# EasyEDA Pro project BrushlessPowerSupply.eprj

# Schematic Schematic1
Board Name: Board1; Create Date: 2025-03-20; Page Name: P1; Project Name: BrushlessPowerSupply; Schematic Name: Schematic1; Update Date: 2025-03-26; Company: 嘉立创EDA; Drawed: 王大智; Page Size: A4; Version: V1.0
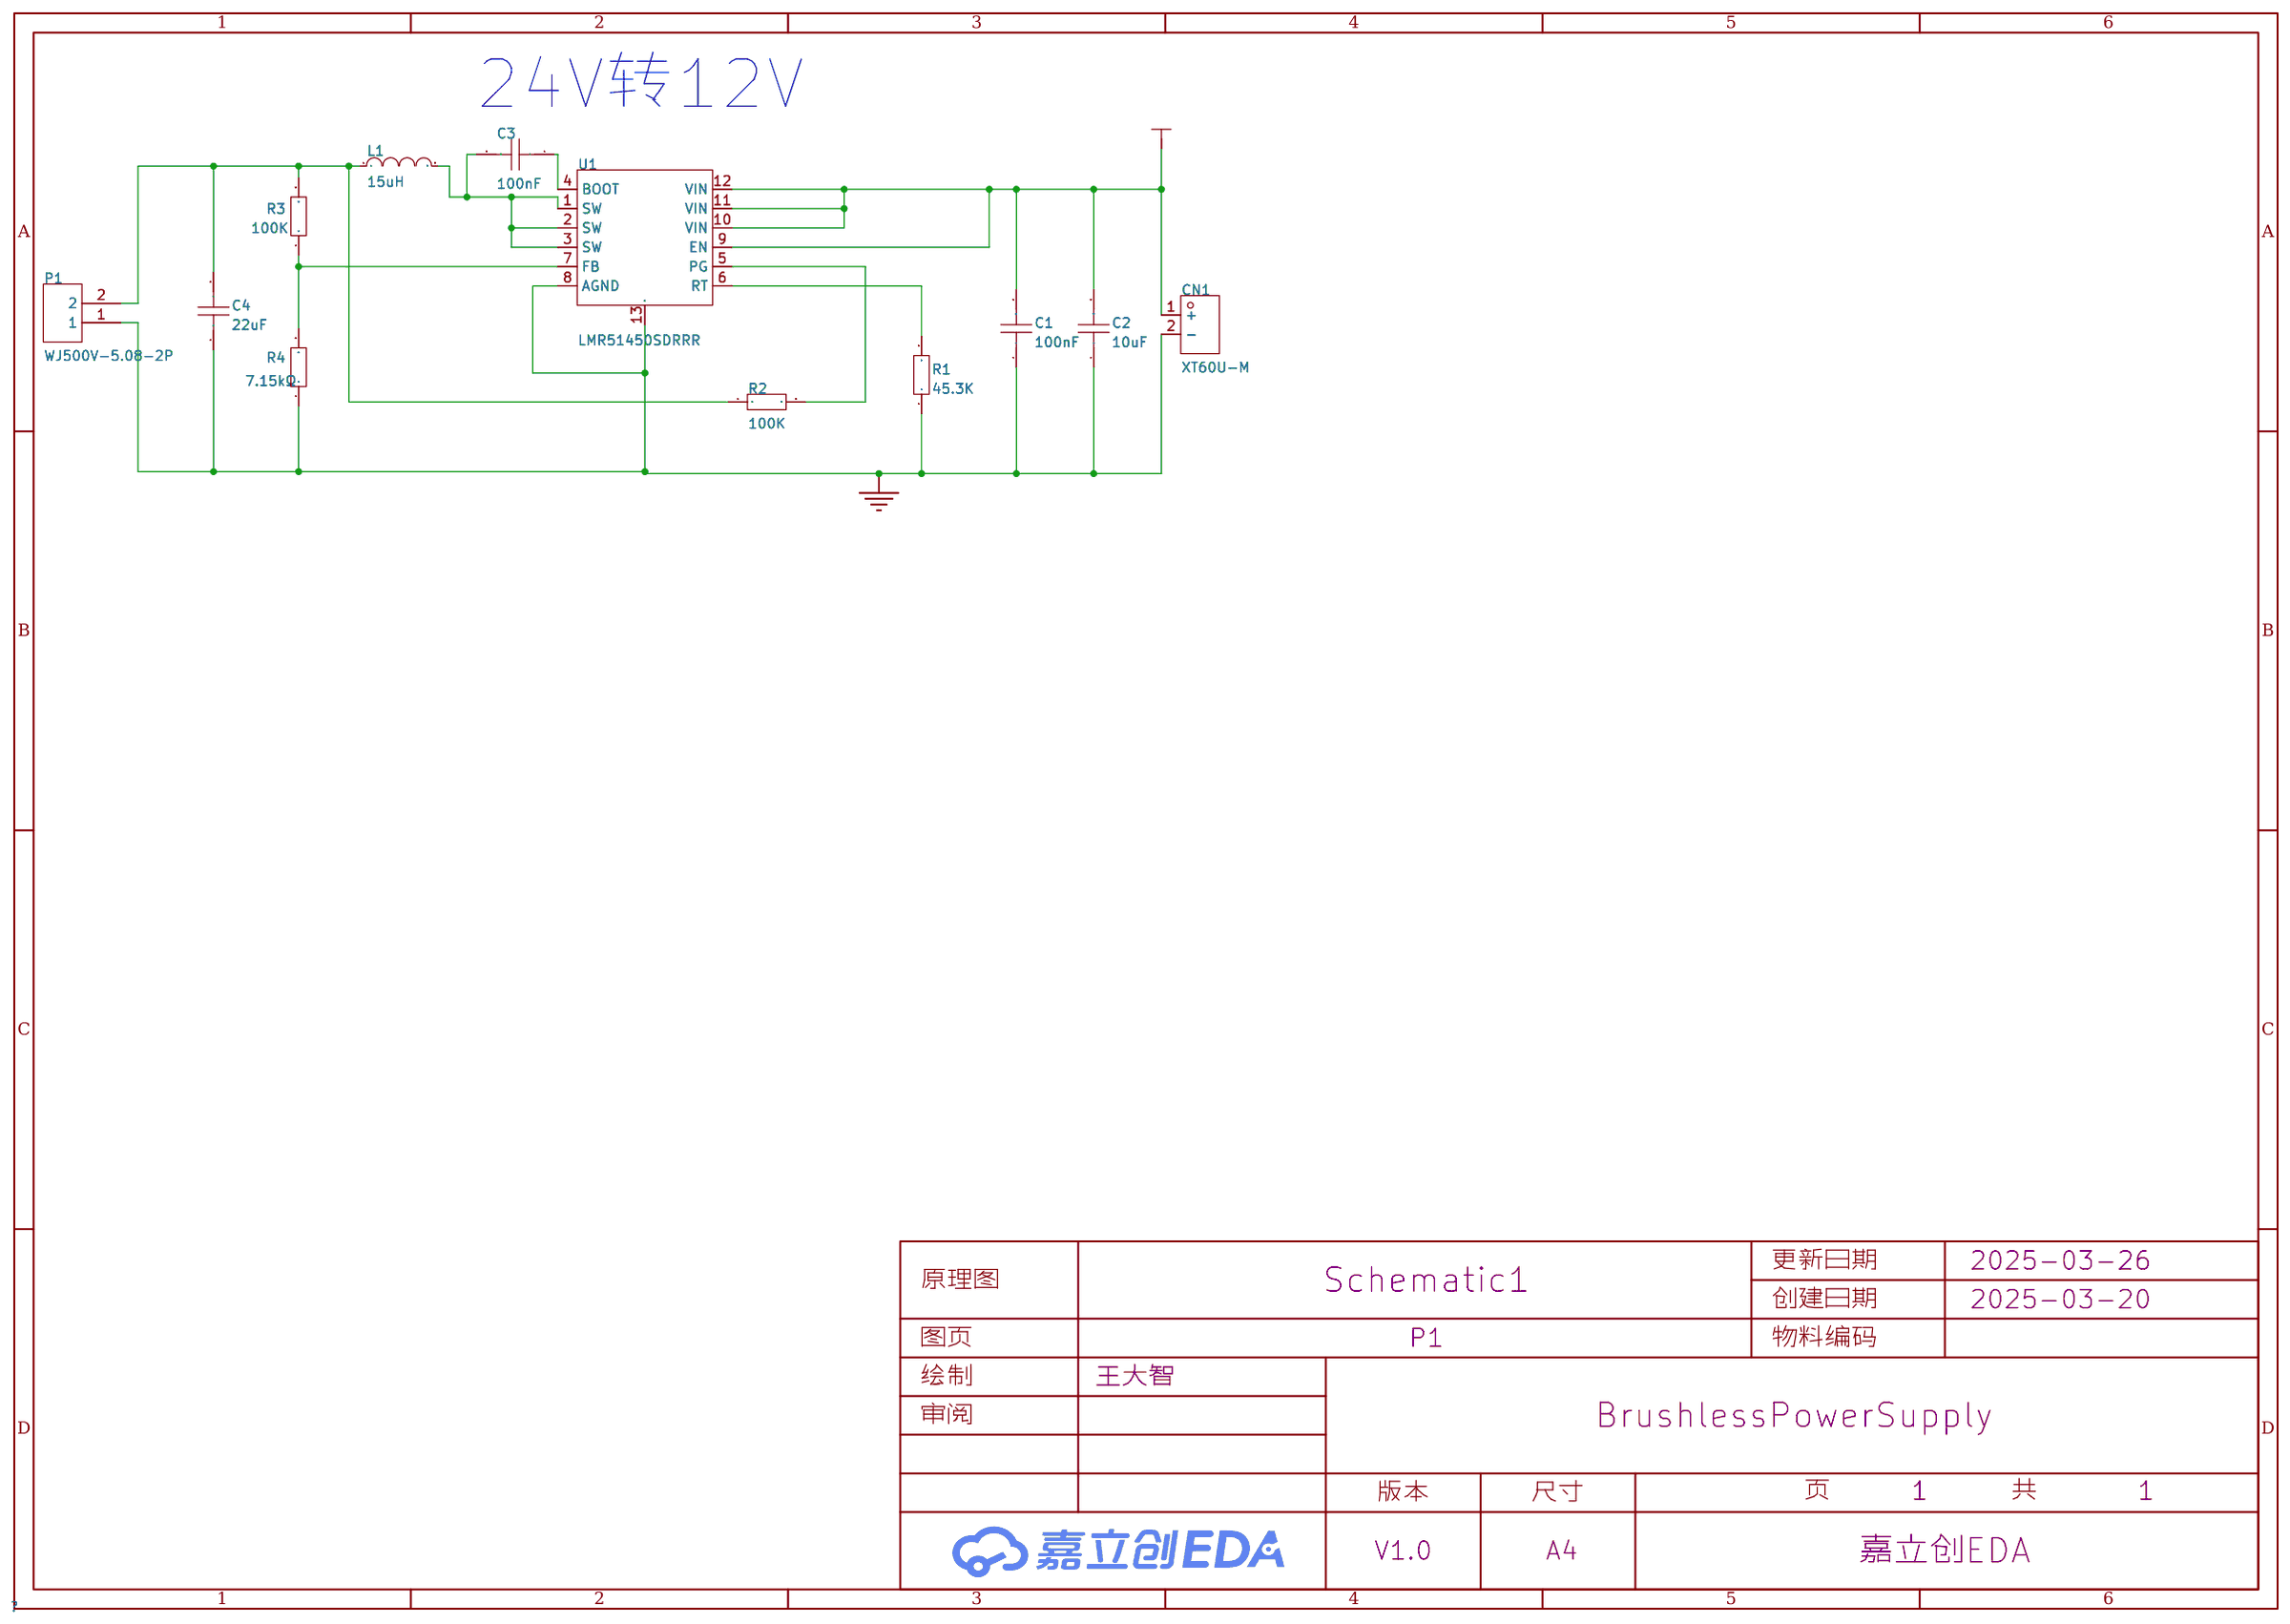
[diagram p0: schematic sheet]

## Parts
C1  100nF  [C0603]
C2  10uF  [C0603]
C3  100nF  [C0603]
C4  22uF  [C0603]
CN1  XT60U-M  [CONN-TH_XT60U-M]
L1  15uH  [L0603]
P1  WJ500V-5.08-2P  [CONN-TH_2P-P5.00_WJ500V-5.08-2P]
R1  45.3K  [R0603]
R2  100K  [R0603]
R3  100K  [R0603]
R4  7.15kΩ  [R0603]
U1  LMR51450SDRRR  [WSON-12_L3.0-W3.0-P0.50-TL-EP-2]

## Library data of the parts
C1-C4 = CAP_0603: Supplier Footprint: 0603
CN1 = XT60U-M: LCSC Part Name: AMASS(艾迈斯)连接器 大电流动力航空插头黄 公头 XT60U-M; Supplier Part: C129184; Manufacturer: AMASS(艾迈斯); JLCPCB Part Class: 扩展库; Datasheet: https://atta.szlcsc.com/upload/public/pdf/source/20180326/C129184_8CCD3C0E138803E0EF0E0B88AC9ACA57.pdf; Supplier: LCSC; Type: 插头; Colour: 黄色; InterfaceType: 公头
L1 = L_0603
P1 = WJ500V-5.08-2P: LCSC Part Name: 1x2P 5.08mm 直插 排数:1 每排P数:2; Supplier Part: C8465; Manufacturer: KANGNEX(康奈克斯电气); Supplier Footprint: 插件,P=5.08mm; JLCPCB Part Class: 扩展库; Datasheet: https://atta.szlcsc.com/upload/public/pdf/source/20191225/C8465_02D34CE5B5B4A53DF5891601D97FA9F4.pdf; Supplier: LCSC; Structure: 1x2P; Pitch: 5.08mm; Color: 绿色; Mounting Style: 直插; Current Rating (Max): 18A; Voltage Rating (Max): 250V; Number of Pins: 2P; Number of Rows: 1; Wire Gauge - AWG: 14~30; Wire Gauge - mm2: 2.5; Number of PINs Per Row: 2; Operating Temperature Range: -40℃~+105℃; Screw Specification: M2.5
R1-R3 = Res_0603: Supplier Footprint: 0603
R4 = 0603WAF7151T5E: LCSC Part Name: 7.15kΩ ±1% 100mW 厚膜电阻; Supplier Part: C25980; Manufacturer: UNI-ROYAL(厚声); Supplier Footprint: 0603; JLCPCB Part Class: Extended Part; Datasheet: https://atta.szlcsc.com/upload/public/pdf/source/20200306/C422600_1E6D84923E4A46A82E41ADD87F860B5C.pdf; Supplier: LCSC; Type: 厚膜电阻; Tolerance: ±1%; Power(Watts): 100mW; Overload Voltage (Max): 75V; Temperature Coefficient: ±100ppm/℃; Operating Temperature Range: -55℃~+155℃
U1 = LMR51450SDRRR: Supplier Part: C6890985; Manufacturer: TI(德州仪器); Supplier Footprint: WSON-12(3x3); JLCPCB Part Class: 扩展库; Datasheet: https://atta.szlcsc.com/upload/public/pdf/source/20230922/F8E6854F02BDF773C7F7ABAF4BB343E7.pdf; Supplier: LCSC; Function: 降压型; Output Type: 可调; Input Voltage: 4V~36V; Output Voltage: 800mV~28V; Output Current (Max): 5A; Switching Frequency: 1.1MHz; Operating Temperature: -40℃~+150℃@(TJ); Synchronous Rectification: 是; Number of Outputs: 1; Topology: 降压式; Switch tube (built-in/external): 内置

## Nets
+24V: C1.2 C2.2 CN1.1(+) U1.9(EN) U1.10(VIN) U1.11(VIN) U1.12(VIN)
GND: C1.1 C2.1 C4.1 CN1.2(-) P1.1 R1.1 R4.1 U1.8(AGND) U1.13(EP)
$1N598: R1.2 U1.6(RT)
$1N771: C3.1 U1.4(BOOT)
$1N912: R2.2 U1.5(PG)
$1N918: C4.2 L1.1 P1.2 R2.1 R3.2
$1N995: R3.1 R4.2 U1.7(FB)
$1N2165: C3.2 L1.2 U1.1(SW) U1.2(SW) U1.3(SW)

## Notes on the sheet
- 24V转12V

# Board PCB1
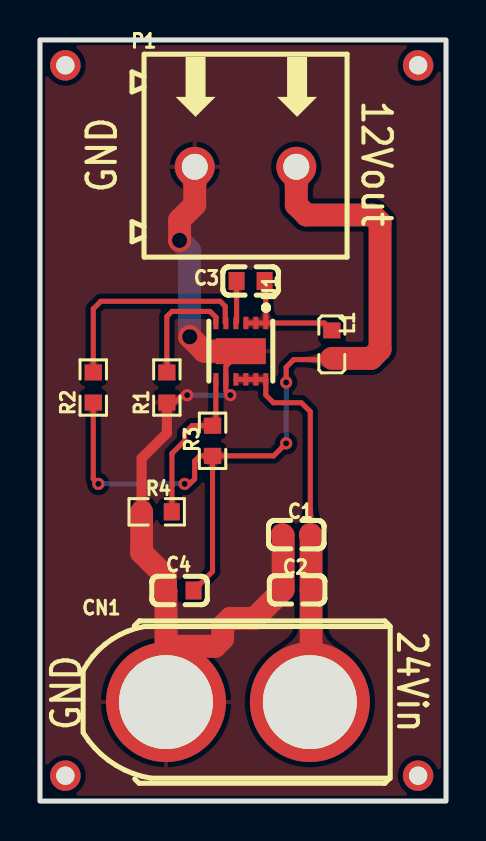
[diagram p1: board, top side]
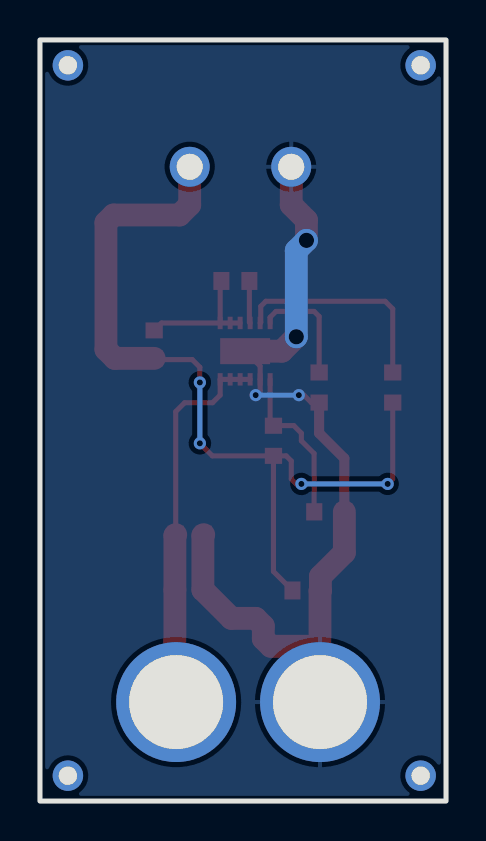
[diagram p2: board, bottom side, seen from below]

Outline 20.32 x 38.1 mm; copper layers: Top Layer, Bottom Layer. Coordinates in mm from the lower left corner of the outline.
Outline path: rectangle 0,38.1 20.32,0
Stack: Top Layer 0.035mm / Dielectric1 1.51mm FR4 er 4.5 / Bottom Layer 0.035mm

## Design rules (mm)
template: JLCPCB Capability(Two Layers Board)
spacing copperThickness1oz (default): track to track 0.102, other pairs 0.152 to 0.3
spacing copperThickness2oz: track to track 0.203, other pairs 0.152 to 0.3
track width copperThickness1oz (default): min 0.127, default 0.254, max 2.54
track width copperThickness2oz: min 0.203, default 0.254, max 2.54
differential pair differentialPair (default): width min 0.127, default 0.254, max 2.54; gap min 0.152, default 0.152
via viaSize (default): diameter min 0.5, default 0.61, max 10; hole min 0.3, default 0.305, max 6.3

## Placement (name value [footprint] x y rotation side)
C1  100nF  [C0603]  12.83 13.33 0 top
C2  10uF  [C0603]  12.87 10.57 0 top
C3  100nF  [C0603]  10.54 26.03 0 top
C4  22uF  [C0603]  6.99 10.54 0 top
CN1  XT60U-M  [CONN-TH_XT60U-M]  9.91 4.95 0 top
L1  15uH  [L0603]  14.6 22.86 90 top
NOREF  -  [Pad_e348]  18.92 36.83 0 top
NOREF#2  -  [Pad_e349]  1.27 1.27 0 top
NOREF#3  -  [Pad_e350]  18.92 1.27 0 top
NOREF#4  -  [Pad_e347]  1.27 36.83 0 top
P1  WJ500V-5.08-2P  [CONN-TH_2P-P5.00_WJ500V-5.08-2P]  10.29 31.75 0 top
R1  45.3K  [R0603]  6.35 20.7 90 top
R2  100K  [R0603]  2.67 20.7 90 top
R3  100K  [R0603]  8.64 18.03 270 top
R4  7.15kΩ  [R0603]  5.84 14.48 0 top
U1  LMR51450SDRRR  [WSON-12_L3.0-W3.0-P0.50-TL-EP-2]  10.05 22.52 270 top

## Footprints (pads in the part's own frame, mm; a bottom-side part is the same pattern mirrored in y, then rotated)
C0603
  rect 0.8x0.9 smd: 1(-0.7,0) 2(0.7,0)
CONN-TH_2P-P5.00_WJ500V-5.08-2P
  round 2 hole 1.3: 1(-2.54,0) 2(2.54,0)
CONN-TH_XT60U-M
  round 6 hole 4.7: 1(3.6,0) 2(-3.6,0)
L0603
  rect 0.8x0.864 smd: 1(-0.7,0) 2(0.7,0)
Pad_e347
  round 1.524 hole 0.914: 1(0,0)
Pad_e348
  round 1.524 hole 0.914: 2(0,0)
Pad_e349
  round 1.524 hole 0.914: 3(0,0)
Pad_e350
  round 1.524 hole 0.914: 4(0,0)
R0603
  rect 0.806x0.864 smd: 1(-0.753,0) 2(0.753,0)
WSON-12_L3.0-W3.0-P0.50-TL-EP-2
  rect 0.623x0.25 smd: 1(-1.411,1.25) 2(-1.411,0.75) 3(-1.411,0.25) 4(-1.411,-0.25) 5(-1.411,-0.75) 6(-1.411,-1.25) 7(1.411,-1.25) 8(1.411,-0.75) 9(1.411,-0.25) 10(1.411,0.25) 11(1.411,0.75) 12(1.411,1.25)
  rect 1.3x2.5 smd: 13(0,0)

## Nets
As in the schematic.

Pads without a net: NOREF 2; NOREF#2 3; NOREF#3 4; NOREF#4 1

## Via types
v1: diameter 0.61, hole 0.305, Top Layer to Bottom Layer, 6 vias
v2: diameter 1.143, hole 0.762, Top Layer to Bottom Layer, 2 vias

## Routing (per net, layer and track width the routed paths; a pad name or vN(x,y) marks a point on that pad's centre or on a via; arc(x,y) is an arc through that point)
+24V: length 19.4
  Top Layer w0.254: 9.8,21.11 11.3,21.11 11.3,20.32 ; C1.2 13.53,19.49 13.08,19.94 11.68,19.94 11.3,20.32
  Top Layer w1.143: C1.2 13.57,13.29 C2.2 13.57,5.02 CN1.1
GND: length 44
  Top Layer w0.254: R1.1 6.74,19.95 7.11,20.32 v1(7.37,20.32) ; 10.01,22.48 9.3,21.77 9.3,20.54 v1(9.53,20.32)
  Top Layer w0.508: R1.1 6.35,18.41 5.09,17.15 R4.1
  Top Layer w1.143: P1.1 7.75,29.84 6.99,29.08 v2(6.99,28.07) ; 6.31,7.77 6.33,7.75 8.76,7.75 9.14,8.13 9.14,8.76 9.53,9.14 10.74,9.14 C2.1 12.17,13.29 C1.1 ; 6.31,7.77 6.31,10.52 6.28,10.54 6.28,11.24 5.09,12.44 R4.1 ; 6.31,7.77 CN1.2 ; 10.01,22.48 U1.13 8.21,22.52 v2(7.49,23.24)
  Bottom Layer w0.254: v1(7.37,20.32) v1(9.53,20.32)
  Bottom Layer w1.143: v2(7.49,23.24) 7.49,27.56 v2(6.99,28.07)
$1N598: length 5.8
  Top Layer w0.254: U1.6 8.8,24.22 8.51,24.51 6.6,24.51 6.35,24.26 R1.2
$1N771: length 2.1
  Top Layer w0.254: C3.1 9.84,23.97 U1.4
$1N912: length 10.9
  Top Layer w0.254: R2.2 2.67,24.64 3.05,25.02 9.02,25.02 9.27,24.77 9.27,23.96 U1.5
$1N918: length 43.8
  Top Layer w0.254: R3.2 8,17.28 7.74,17.02 7.74,16.12 7.49,15.88 v1(7.24,15.88) ; R3.2 8.64,11.49 C4.2 ; R3.2 11.69,17.28 v1(12.32,17.91) ; R2.1 2.67,16.13 v1(2.92,15.88) ; v1(12.32,20.95) 12.32,21.72 12.7,22.1 14.54,22.1 L1.1
  Top Layer w1.143: P1.2 12.83,29.84 13.34,29.34 16.64,29.34 17.02,28.96 17.02,22.61 16.57,22.16 L1.1
  Bottom Layer w0.254: v1(12.32,20.95) v1(12.32,17.91) ; v1(7.24,15.88) v1(2.92,15.88)
$1N995: length 8.2
  Top Layer w0.254: R4.2 6.6,14.49 6.6,17.4 7.24,18.03 7.24,18.41 7.62,18.8 8.63,18.8 R3.1 8.8,18.95 8.8,21.11
$1N2165: length 6.6
  Top Layer w0.254: U1.1 U1.2 U1.3 ; U1.1 11.3,25.97 C3.2 ; U1.1 14.23,23.93 L1.2

## Copper pours and planes (outline as drawn; the poured copper is in the pictures)
GND on Top Layer: -5.84,40.64 26.8,40.64 26.8,-4.06 -5.84,-4.06
GND on Bottom Layer: -5.84,41.91 26.29,41.91 26.29,-7.62 -5.84,-7.62

Small or netless copper shapes (teardrops, artwork), in the pictures only: 42 on Top Layer, 6 on Bottom Layer

## Text on the board
Top Silkscreen Layer: GND | 12Vout | 24Vin
